# Altium schematic sheet 2019_FDP_SCHEMA.SchDoc
size A3
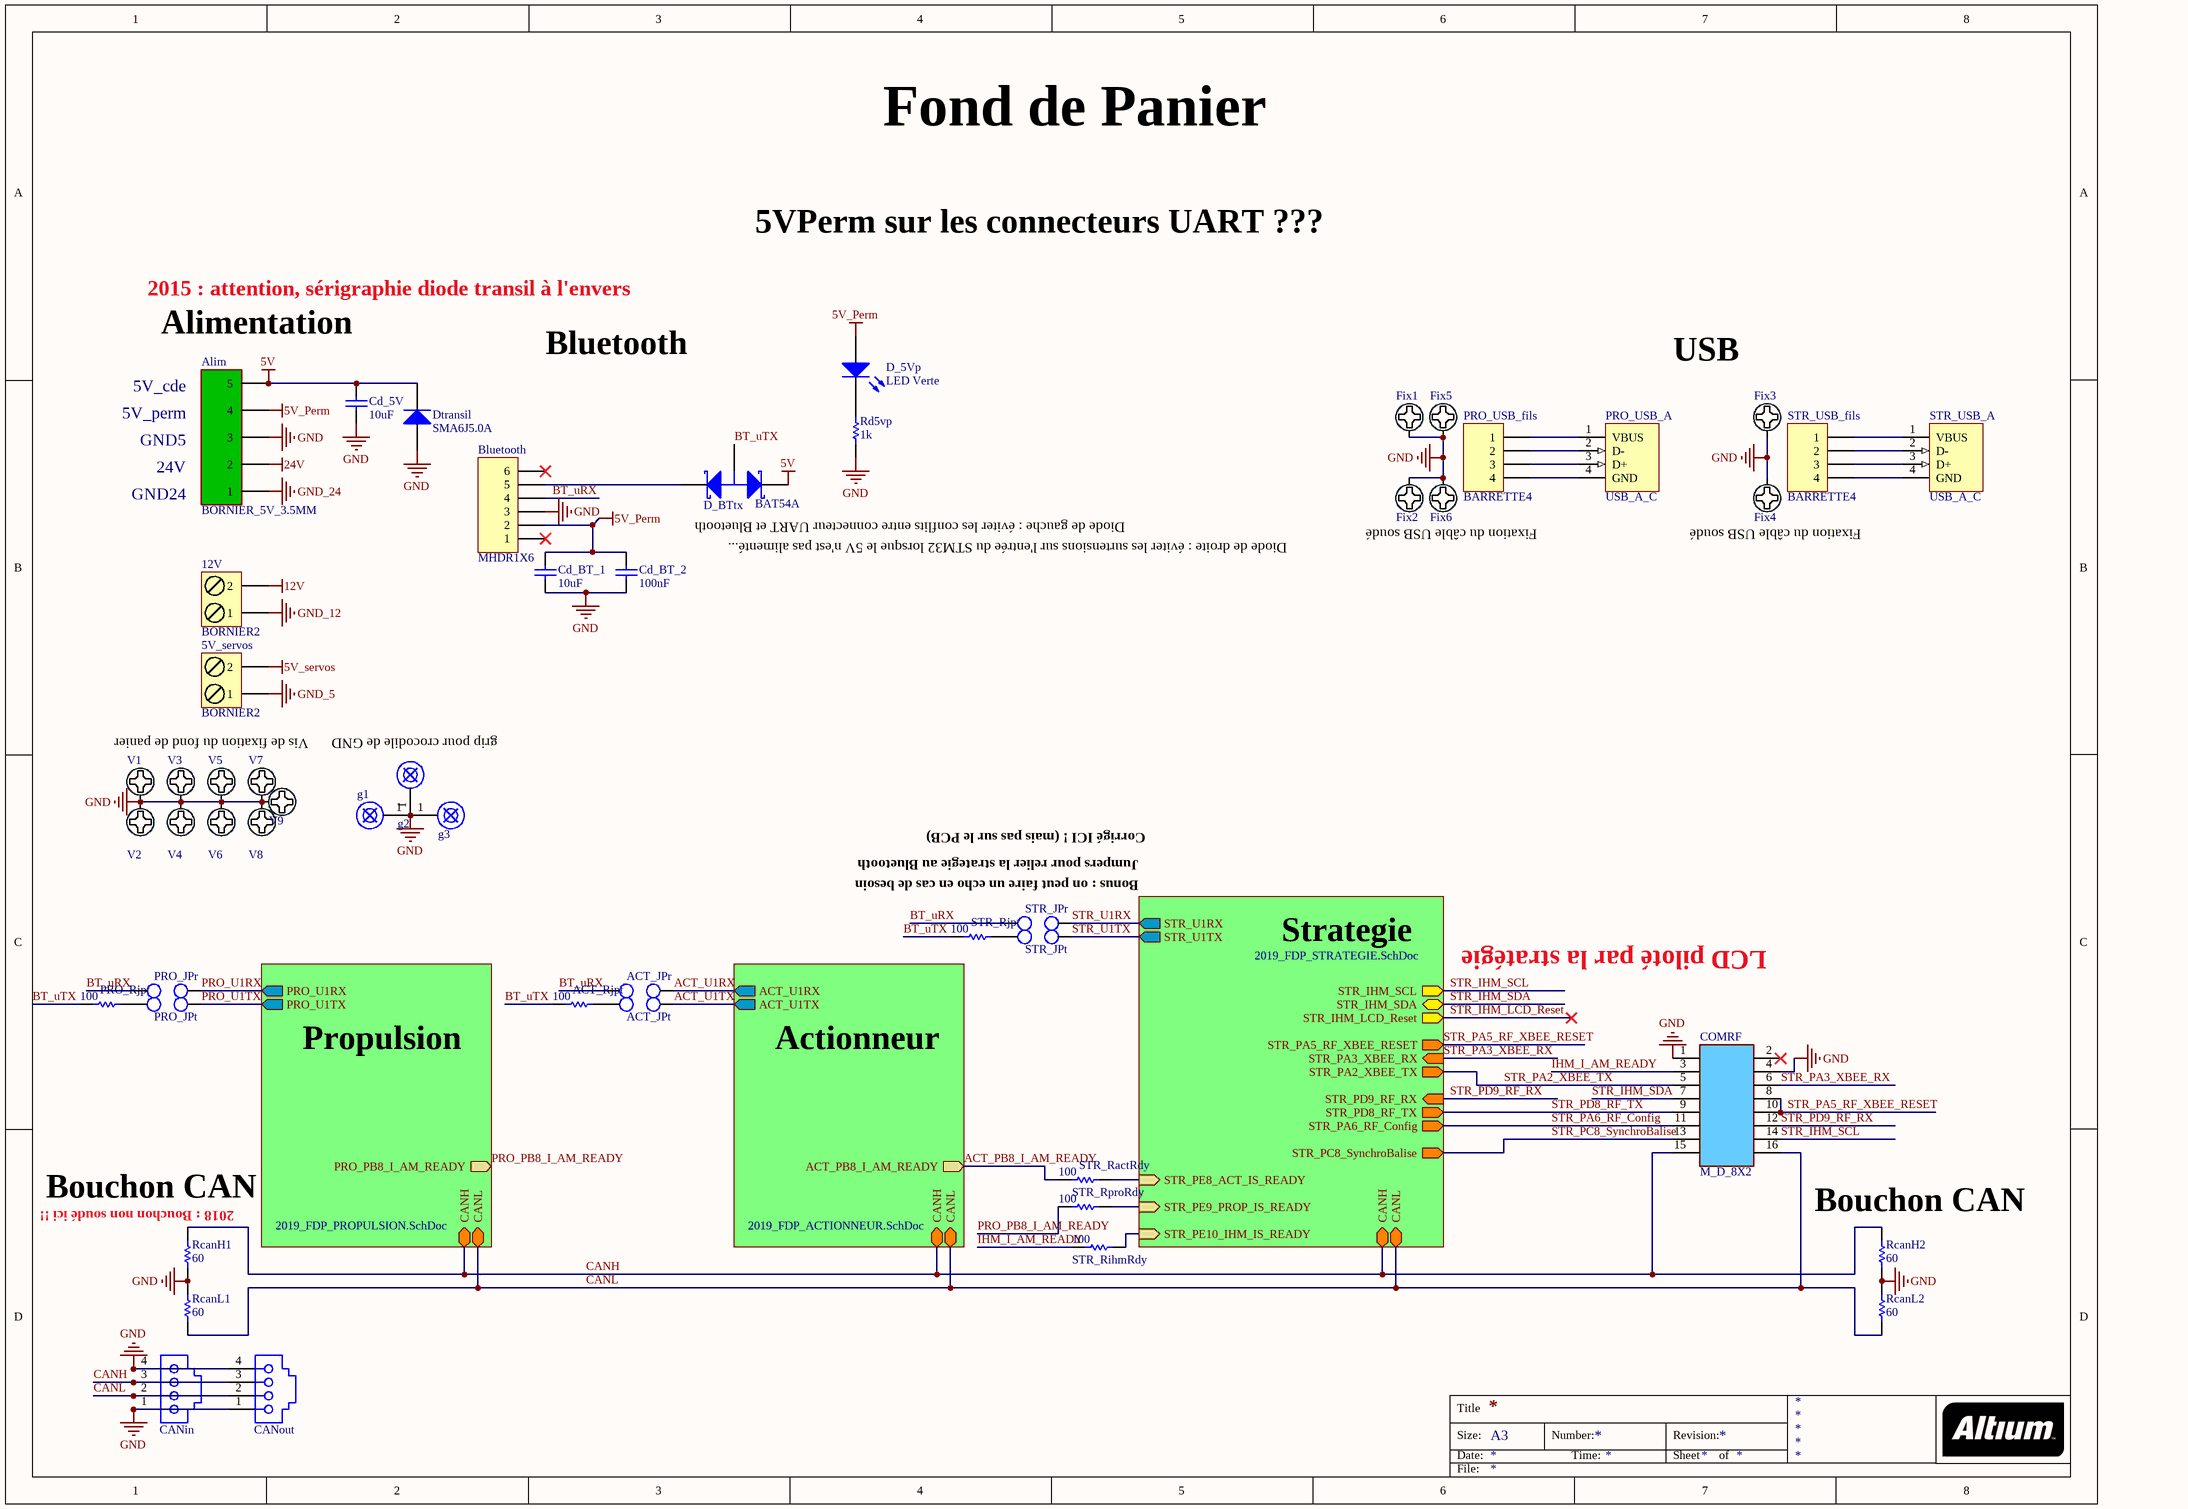
[diagram p0: 2019_FDP_SCHEMA.SchDoc]

## Parts
5V_servos  BORNIER2  [BORNIER_2V_5.08MM]
12V  BORNIER2  [BORNIER_2V_5.08MM]
ACT_JPr  JUMPER2  [BARRETTE_2_M_D]  (value not drawn)
ACT_JPt  JUMPER2  [BARRETTE_2_M_D]  (value not drawn)
ACT_Rjpt  100  [R1206_N]
Alim  BORNIER_5V_3.5MM  [BORNIER_5V_3.5MM_femelle_0]
Bluetooth  MHDR1X6  [HE14_6]
CANin  634104149621  [634104149621]  (value not drawn)
CANout  634104149621  [634104149621]  (value not drawn)
Cd_5V  10uF  [C1206_N]
Cd_BT_1  10uF  [C1206_N]
Cd_BT_2  100nF  [C0805_N]
COMRF  Type: M_D_8X2  [HE10/16_M_D_B P]  (hidden comment: BARRETTE_8 CONTACTS_2 RANGEES_MALE_DROITE)
D_5Vp  LED Verte  [LED_0805]
D_BTtx  BAT54A  [SOT23-3N]
Dtransil  SMA6J5.0A  [DO214AC]
Fix1  Pad_M3  [Point Test_D3_P1.6mm]  (value not drawn)
Fix2  Pad_M3  [Point Test_D3_P1.6mm]  (value not drawn)
Fix3  Pad_M3  [Point Test_D3_P1.6mm]  (value not drawn)
Fix4  Pad_M3  [Point Test_D3_P1.6mm]  (value not drawn)
Fix5  Pad_M3  [Point Test_D3_P1.6mm]  (value not drawn)
Fix6  Pad_M3  [Point Test_D3_P1.6mm]  (value not drawn)
g1  grip  [POINT_TEST]  (value not drawn)
g2  grip  [POINT_TEST]  (value not drawn)
g3  grip  [POINT_TEST]  (value not drawn)
PRO_JPr  JUMPER2  [BARRETTE_2_M_D]  (value not drawn)
PRO_JPt  JUMPER2  [BARRETTE_2_M_D]  (value not drawn)
PRO_Rjpt  100  [R1206_N]
PRO_USB_A  USB_A_COUDEE  [USB_A_C]  (value not drawn)
PRO_USB_fils  BARRETTE4  [HE14_4]
RcanH1  60  [R1206_N]
RcanH2  60  [R1206_N]
RcanL1  60  [R1206_N]
RcanL2  60  [R1206_N]
Rd5vp  1k  [R1206_N]
STR_JPr  JUMPER2  [BARRETTE_2_M_D]  (value not drawn)
STR_JPt  JUMPER2  [BARRETTE_2_M_D]  (value not drawn)
STR_RactRdy  100  [R1206_N]
STR_RihmRdy  100  [R1206_N]
STR_Rjpt  100  [R1206_N]
STR_RproRdy  100  [R1206_N]
STR_USB_A  USB_A_COUDEE  [USB_A_C]  (value not drawn)
STR_USB_fils  BARRETTE4  [HE14_4]
V1  Pad_M3  [M3x6mm Torx]  (value not drawn)
V2  Pad_M3  [M3x6mm Torx]  (value not drawn)
V3  Pad_M3  [M3x6mm Torx]  (value not drawn)
V4  Pad_M3  [M3x6mm Torx]  (value not drawn)
V5  Pad_M3  [M3x6mm Torx]  (value not drawn)
V6  Pad_M3  [M3x6mm Torx]  (value not drawn)
V7  Pad_M3  [M3x6mm Torx]  (value not drawn)
V8  Pad_M3  [M3x6mm Torx]  (value not drawn)
V9  Pad_M3  [M3x6mm Torx]  (value not drawn)

## Sub-sheets
Actionneur = 2019_FDP_ACTIONNEUR.SchDoc: CANH (bidir), CANL (bidir), ACT_U1RX (out), ACT_U1TX (out), ACT_PB8_I_AM_READY (out)
Propulsion = 2019_FDP_PROPULSION.SchDoc: CANH (bidir), CANL (bidir), PRO_U1RX (out), PRO_U1TX (out), PRO_PB8_I_AM_READY (out)
Strategie = 2019_FDP_STRATEGIE.SchDoc: STR_IHM_SCL (out), STR_IHM_SDA (bidir), STR_IHM_LCD_Reset (out), STR_PA3_XBEE_RX (in), STR_PA2_XBEE_TX (out), STR_PA5_RF_XBEE_RESET (out), STR_PA6_RF_Config (out), STR_PC8_SynchroBalise (out), STR_PD8_RF_TX (out), STR_PD9_RF_RX (in), CANL (bidir), CANH (bidir), STR_U1RX (out), STR_U1TX (out), STR_PE9_PROP_IS_READY (in), STR_PE8_ACT_IS_READY (in), STR_PE10_IHM_IS_READY (in)

## Nets
5V: Alim.5 Cd_5V.2 D_BTtx.2(K2) Dtransil.2(K)
5V_Perm: Alim.4 Bluetooth.2 Cd_BT_1.2 Cd_BT_2.2 D_5Vp.1(A)
5V_servos: 5V_servos.2
12V: 12V.2
24V: Alim.2
GND: Alim.3 Bluetooth.3 CANin.1 CANin.4 CANout.1 CANout.4 Cd_5V.1 Cd_BT_1.1 Cd_BT_2.1 COMRF.1 COMRF.4 Dtransil.1(A) Fix1.1 Fix2.1 Fix3.1 Fix4.1 Fix5.1 Fix6.1 g1.1 g2.1 g3.1 RcanH1.1 RcanH2.2 RcanL1.2 RcanL2.2 Rd5vp.2 V1.1 V2.1 V3.1 V4.1 V5.1 V6.1 V7.1 V8.1 V9.1
GND_5: 5V_servos.1
GND_12: 12V.1
GND_24: Alim.1
ACT_PB8_I_AM_READY: STR_RactRdy.2 ; sheet Actionneur/ACT_PB8_I_AM_READY
ACT_U1RX: ACT_JPr.2 ; sheet Actionneur/ACT_U1RX
ACT_U1TX: ACT_JPt.2 ; sheet Actionneur/ACT_U1TX
BT_uRX: ACT_JPr.1 Bluetooth.4 PRO_JPr.1 STR_JPr.1
BT_uTX: ACT_Rjpt.2 D_BTtx.3(A) PRO_Rjpt.2 STR_Rjpt.2
CANH: CANin.3 CANout.3 COMRF.15 RcanH1.2 RcanH2.1 ; sheet Propulsion/CANH, sheet Strategie/CANH, sheet Actionneur/CANH
CANL: CANin.2 CANout.2 COMRF.16 RcanL1.1 RcanL2.1 ; sheet Propulsion/CANL, sheet Strategie/CANL, sheet Actionneur/CANL
IHM_I_AM_READY: COMRF.3 STR_RihmRdy.2
PRO_PB8_I_AM_READY: STR_RproRdy.2 ; sheet Propulsion/PRO_PB8_I_AM_READY
PRO_U1RX: PRO_JPr.2 ; sheet Propulsion/PRO_U1RX
PRO_U1TX: PRO_JPt.2 ; sheet Propulsion/PRO_U1TX
STR_IHM_LCD_Reset: sheet Strategie/STR_IHM_LCD_Reset
STR_IHM_SCL: COMRF.14 ; sheet Strategie/STR_IHM_SCL
STR_IHM_SDA: COMRF.7 ; sheet Strategie/STR_IHM_SDA
STR_PA2_XBEE_TX: COMRF.5 ; sheet Strategie/STR_PA2_XBEE_TX
STR_PA3_XBEE_RX: COMRF.6 ; sheet Strategie/STR_PA3_XBEE_RX
STR_PA5_RF_XBEE_RESET: COMRF.8 COMRF.10 ; sheet Strategie/STR_PA5_RF_XBEE_RESET
STR_PA6_RF_Config: COMRF.11 ; sheet Strategie/STR_PA6_RF_Config
STR_PC8_SynchroBalise: COMRF.13 ; sheet Strategie/STR_PC8_SynchroBalise
STR_PD8_RF_TX: COMRF.9 ; sheet Strategie/STR_PD8_RF_TX
STR_PD9_RF_RX: COMRF.12 ; sheet Strategie/STR_PD9_RF_RX
STR_U1RX: STR_JPr.2 ; sheet Strategie/STR_U1RX
STR_U1TX: STR_JPt.2 ; sheet Strategie/STR_U1TX
NetACT_JPt_1: ACT_JPt.1 ACT_Rjpt.1
NetBluetooth_5: Bluetooth.5 D_BTtx.1(K1)
NetD_5Vp_2: D_5Vp.2(K) Rd5vp.1
NetPRO_JPt_1: PRO_JPt.1 PRO_Rjpt.1
NetPRO_USB_A_1: PRO_USB_A.1(VBUS) PRO_USB_fils.1
NetPRO_USB_A_2: PRO_USB_A.2(D-) PRO_USB_fils.2
NetPRO_USB_A_3: PRO_USB_A.3(D+) PRO_USB_fils.3
NetPRO_USB_A_4: PRO_USB_A.4(GND) PRO_USB_fils.4
NetSTR_JPt_1: STR_JPt.1 STR_Rjpt.1
NetSTR_RactRdy_1: STR_RactRdy.1 ; sheet Strategie/STR_PE8_ACT_IS_READY
NetSTR_RihmRdy_1: STR_RihmRdy.1 ; sheet Strategie/STR_PE10_IHM_IS_READY
NetSTR_RproRdy_1: STR_RproRdy.1 ; sheet Strategie/STR_PE9_PROP_IS_READY
NetSTR_USB_A_1: STR_USB_A.1(VBUS) STR_USB_fils.1
NetSTR_USB_A_2: STR_USB_A.2(D-) STR_USB_fils.2
NetSTR_USB_A_3: STR_USB_A.3(D+) STR_USB_fils.3
NetSTR_USB_A_4: STR_USB_A.4(GND) STR_USB_fils.4

Not connected (* = marked no-connect by the designer): Bluetooth 1* 6*; COMRF 2*

## Notes on the sheet
- Fond de Panier
- 5VPerm sur les connecteurs UART ???
- 2015 : attention, sérigraphie diode transil à l'envers
- Alimentation
- Bluetooth
- USB
- 5V_perm
- 5V_cde
- GND5
- 24V
- GND24
- Diode de gauche : éviter les conflits entre connecteur UART et Bluetooth
- (near Cd_BT_2) Diode de droite : éviter les surtensions sur l'entrée du STM32 lorsque le 5V n'est pas alimenté...
- Fixation du câble USB soudé
- Vis de fixation du fond de panier
- (near g2) grip pour crocodile de GND
- Jumpers pour relier la strategie au Bluetooth
- Corrigé ICI ! (mais pas sur le PCB)
- Bonus : on peut faire un echo en cas de besoin
- LCD piloté par la stratégie
- (near RcanH1) Bouchon CAN
- (near RcanH1) 2018 : Bouchon non soudé ici !!
- (near RcanH2) Bouchon CAN
- Title
- Size:
- Date:
- A3
- Number:
- Time:
- Revision:
- Sheet
- of
- File:

## Library data of the parts
5V_servos 12V = BORNIER2: Terminal blocks, 2 pins, pitch=5mm
ACT_JPr ACT_JPt PRO_JPr PRO_JPt STR_JPr STR_JPt = JUMPER2: BARRETTE 2 CONTACTS 1 RANGEE MALE DROITE; Type: JUMPER2
ACT_Rjpt PRO_Rjpt RcanH1 RcanH2 RcanL1 RcanL2 Rd5vp STR_RactRdy STR_RihmRdy STR_Rjpt STR_RproRdy = Resistor: Published: 8-Jun-2000; LatestRevisionDate: 17-Jul-2002; LatestRevisionNote: Re-released for DXP Platform.; PackageReference: AXIAL-0.5; Publisher: Altium Limited
Bluetooth = MHDR1X6: Header, 6-Pin; LatestRevisionDate: 17-Jul-2002; LatestRevisionNote: Re-released for DXP Platform.; Publisher: Altium Limited
CANin CANout = 634104149621: Modular Jack SMT Vertical Plastic 4P4C Top Entry WR-MJ; Rated Current: 1.5 A; Working Voltage: 120 VAC; Withstanding Voltage: 1000 VAC; Port: 1x1; ComponentLink1Description: Manufacturer; ComponentLink1URL: http://www.we-online.de; ComponentLink2Description: Datasheet; ComponentLink2URL: http://katalog.we-online.com/em/datasheet/634104149621.pdf; Part Number: 634104149621; Published Date: September 2017; Publisher: Wurth Elektronik; Pin Number: 4P4C; Entrance: Vertical
Cd_5V Cd_BT_1 Cd_BT_2 = Condensateur: Capacitor; Published: 8-Jun-2000; LatestRevisionDate: 17-Jul-2002; LatestRevisionNote: Re-released for DXP Platform.; PackageReference: RAD-0.3; Publisher: Altium Limited
D_5Vp = LED: Typical LED; Published: 8-Jun-2000; LatestRevisionDate: 08-Jul-2005; LatestRevisionNote: Mech Layer 1 removed.; PackageReference: LED-1; Publisher: Altium Limited
D_BTtx = Diode Shottky double  BAT54A: DIODE SCHOTTKY DOUBLE; Manufacturer: ZETEX; ComponentLink1URL: http://www.farnell.com/datasheets/27632.pdf; ComponentLink1Description: http://www.farnell.com/datasheets/27632.pdf; Supplier Part Number: 9526498; Supplier: Farnell; RoHS: YES; Manufacturer Part Number: BAT54A
Dtransil = Diode 1N4001: 1 Amp General Purpose Rectifier; Published: 8-Jun-2000; LatestRevisionDate: 17-Jul-2002; LatestRevisionNote: Re-released for DXP Platform.; DatasheetVersion: 1998; PackageVersion: Aug-1999; PackageReference: DO-41; Publisher: Altium Limited; Code_JEDEC: DO-204-AL; ComponentLink1Description: Manufacturer Link; ComponentLink1URL: http://www.fairchildsemi.com/; ComponentLink2Description: Datasheet; ComponentLink2URL: http://www.fairchildsemi.com/ds/1N%2F1N4001.pdf
Fix1-Fix6 V1-V9 = Vis M3 X 6mm _TORX_Tête 6mm: Publisher: Damien Guitton
g1-g3 = POINT_TEST: POINT TEST
PRO_USB_A STR_USB_A = USB_A_COUDEE: EMBASE USB TRAVERSANTE TYPE A COUDEE; Type: USB_A_C
PRO_USB_fils STR_USB_fils = BARRETTE4: Header, 4-Pin; LatestRevisionDate: 17-Jul-2002; LatestRevisionNote: Re-released for DXP Platform.; Publisher: Altium Limited